# EAGLE design Daughter2 (EAGLE 9.6.2)
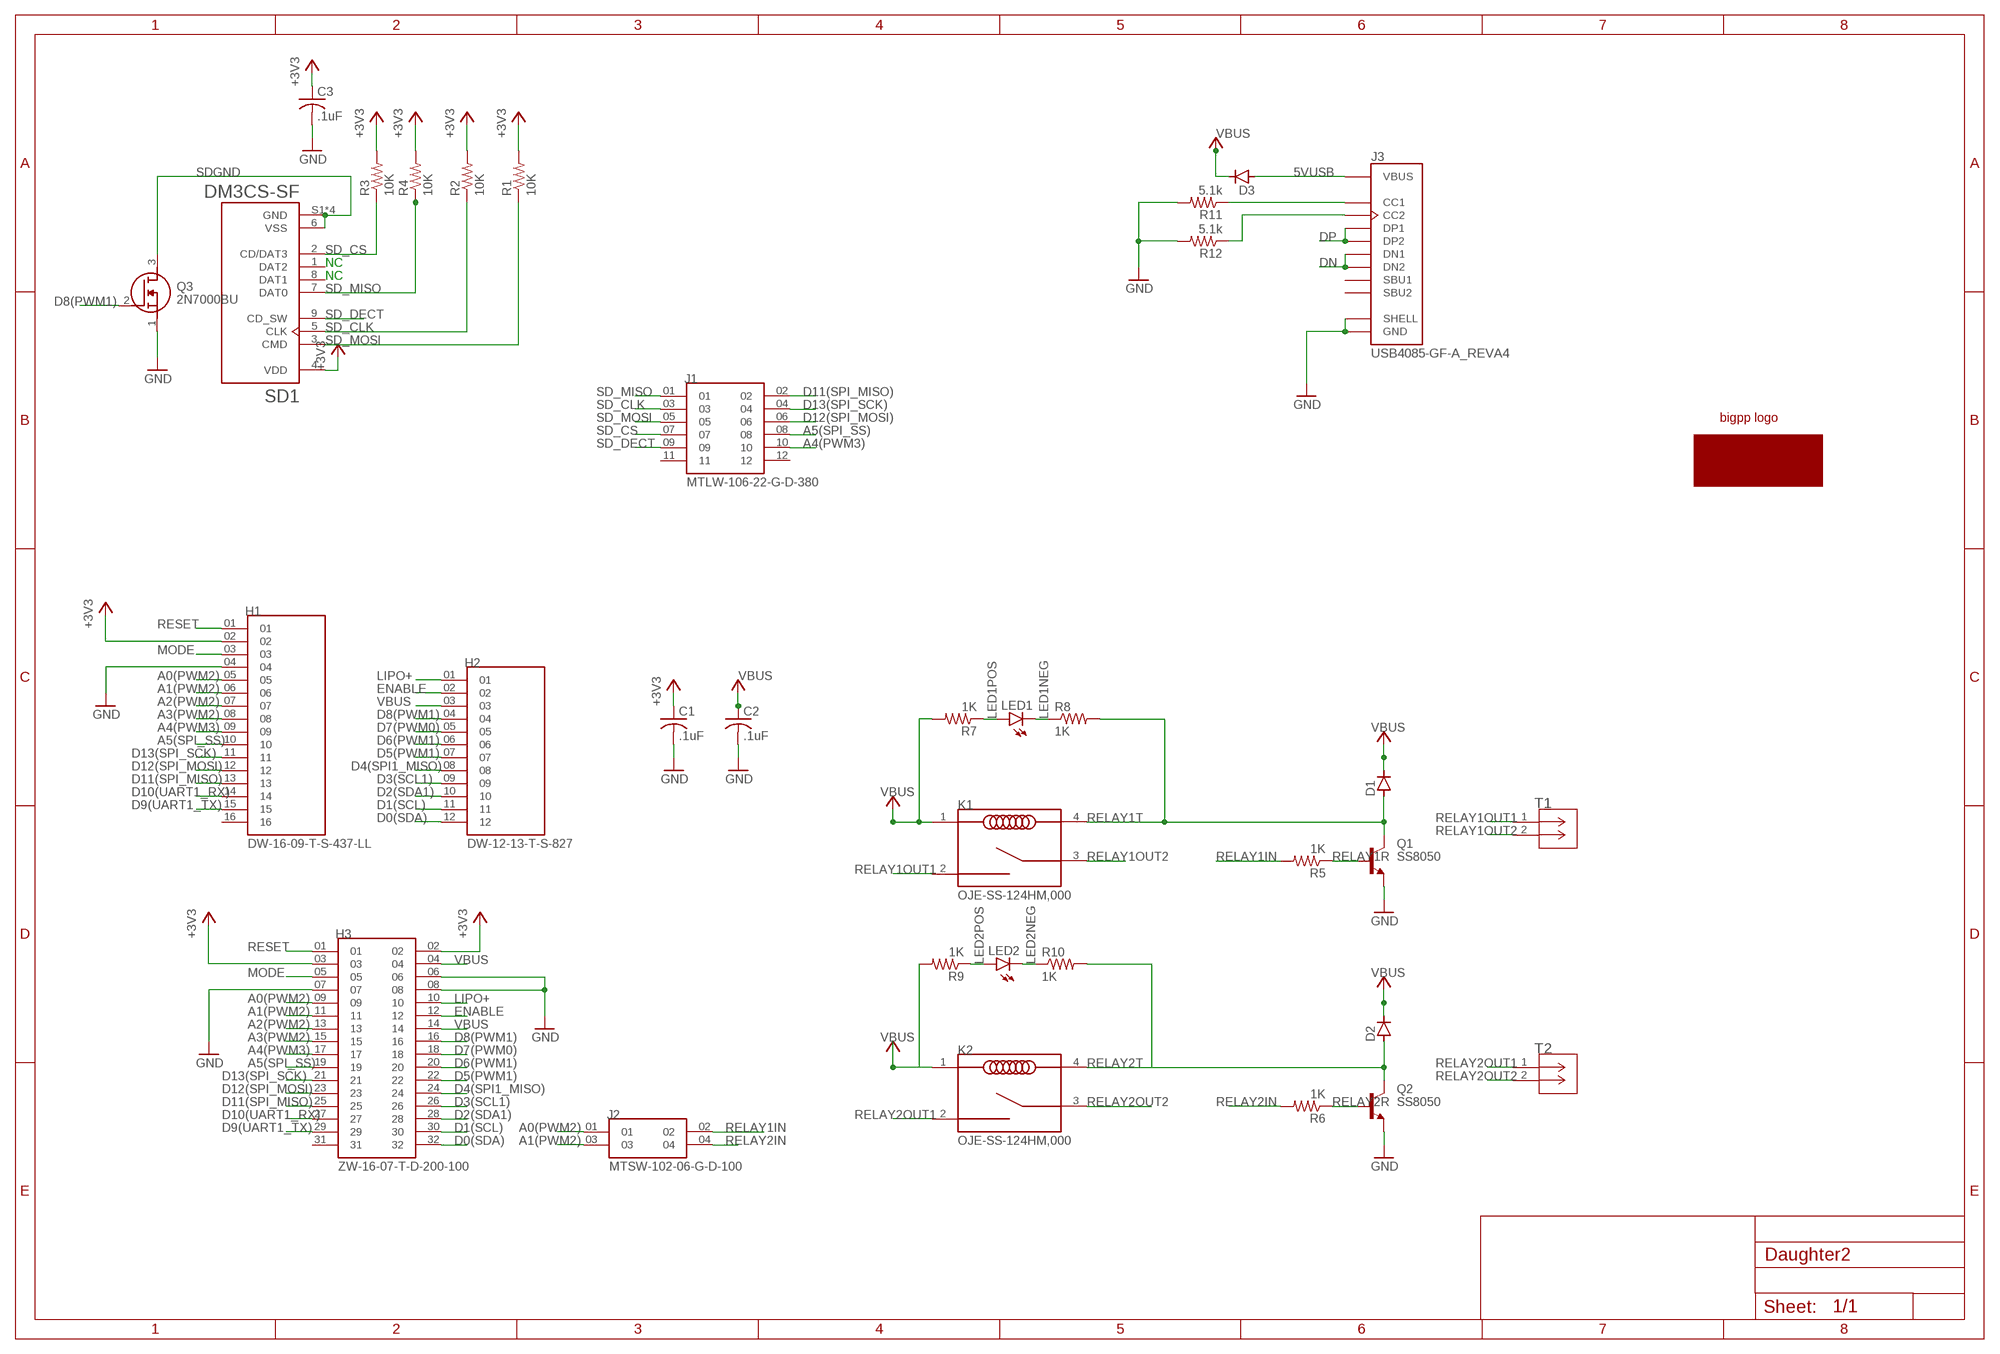
[diagram p0: schematic, sheet 1]

## Parts
C1  .1uF  C-USC0805  [C0805]
C2  .1uF  C-USC0805  [C0805]
C3  .1uF  C-USC0805  [C0805]
D1  D-SOD-80  [SOD80]
D2  D-SOD-80  [SOD80]
D3  D-SOD-80  [SOD80]
H1  DW-16-09-T-S-437-LL  [SAMTEC_DW-16-09-T-S-437-LL]
H2  DW-12-13-T-S-827  [SAMTEC_DW-12-13-T-S-827]
H3  ZW-16-07-T-D-200-100  [SAMTEC_ZW-16-07-T-D-200-100]
J1  MTLW-106-22-G-D-380  [SAMTEC_MTLW-106-22-G-D-380]
J2  MTSW-102-06-G-D-100  [SAMTEC_MTSW-102-06-G-D-100]
J3  USB4085-GF-A_REVA4  [GCT_USB4085-GF-A_REVA4]
K1  OJE-SS-124HM,000  [RELAY_OJE-SS-124HM,000]
K2  OJE-SS-124HM,000  [RELAY_OJE-SS-124HM,000]
LED1  LEDCHIP-LED0603  [CHIP-LED0603]
LED2  LEDCHIP-LED0603  [CHIP-LED0603]
Q1  SS8050  [SOT-23_BEC]
Q2  SS8050  [SOT-23_BEC]
Q3  2N7000BU  [2N6027]
R1  10K  R-US_R0805  [R0805]
R2  10K  R-US_R0805  [R0805]
R3  10K  R-US_R0805  [R0805]
R4  10K  R-US_R0805  [R0805]
R5  1K  R-US_R0805  [R0805]
R6  1K  R-US_R0805  [R0805]
R7  1K  R-US_R0805  [R0805]
R8  1K  R-US_R0805  [R0805]
R9  1K  R-US_R0805  [R0805]
R10  1K  R-US_R0805  [R0805]
R11  5.1k  R-US_R0805  [R0805]
R12  5.1k  R-US_R0805  [R0805]
SD1  DM3CS-SF  [HRS_DM3CS-SF]
T1  OSTVN02A150  [CONN_OSTVN02A150_OST]
T2  OSTVN02A150  [CONN_OSTVN02A150_OST]
U$1  BIGPP  [BIGPP]

## Nets
5VUSB: D3.2(A) J3.A4(VBUS) J3.A9(VBUS) J3.B4(VBUS) J3.B9(VBUS)
+3V3: C1.1 C3.1 H1.02 H3.02 H3.03 R1.2 R2.2 R3.2 R4.2 SD1.4(VDD)
A0(PWM2): H1.05 H3.09 J2.01
A1(PWM2): H1.06 H3.11 J2.03
A2(PWM2): H1.07 H3.13
A3(PWM2): H1.08 H3.15
A4(PWM3): H1.09 H3.17 J1.10
A5(SPI_SS): H1.10 H3.19 J1.08
D0(SDA): H2.12 H3.32
D1(SCL): H2.11 H3.30
D2(SDA1): H2.10 H3.28
D3(SCL1): H2.09 H3.26
D4(SPI1_MISO): H2.08 H3.24
D5(PWM1): H2.07 H3.22
D6(PWM1): H2.06 H3.20
D7(PWM0): H2.05 H3.18
D8(PWM1): H2.04 H3.16 Q3.2(G)
D9(UART1_TX): H1.15 H3.29
D10(UART1_RX): H1.14 H3.27
D11(SPI_MISO): H1.13 H3.25 J1.02
D12(SPI_MOSI): H1.12 H3.23 J1.06
D13(SPI_SCK): H1.11 H3.21 J1.04
DN: J3.A7(DN1) J3.B7(DN2)
DP: J3.A6(DP1) J3.B6(DP2)
ENABLE: H2.02 H3.12
GND: C1.2 C2.2 C3.2 H1.04 H3.06 H3.07 H3.08 J3.A1(GND) J3.A12(GND) J3.B1(GND) J3.B12(GND) J3.P1(SHELL) J3.P2(SHELL) J3.P3(SHELL) J3.P4(SHELL) Q1.E Q2.E Q3.1(S) R11.2 R12.2
LED1NEG: LED1.C R8.1
LED1POS: LED1.A R7.1
LED2NEG: LED2.C R10.1
LED2POS: LED2.A R9.1
LIPO+: H2.01 H3.10
MODE: H1.03 H3.05
N$1: J3.A5(CC1) R11.1
N$4: J3.B5(CC2) R12.1
RELAY1IN: J2.02 R5.2
RELAY1OUT1: K1.2 T1.1
RELAY1OUT2: K1.3 T1.2
RELAY1R: Q1.B R5.1
RELAY1T: D1.2(A) K1.4 Q1.C R8.2
RELAY1T1: R10.2
RELAY2IN: J2.04 R6.2
RELAY2OUT1: K2.2 T2.1
RELAY2OUT2: K2.3 T2.2
RELAY2R: Q2.B R6.1
RELAY2T: D2.2(A) K2.4 Q2.C
RESET: H1.01 H3.01
SD_CLK: J1.03 R2.1 SD1.5(CLK)
SD_CS: J1.07 R3.1 SD1.2(CD/DAT3)
SD_DECT: J1.09 SD1.9(CD_SW)
SD_MISO: J1.01 R4.1 SD1.7(DAT0)
SD_MOSI: J1.05 R1.1 SD1.3(CMD)
SDGND: Q3.3(D) SD1.6(VSS) SD1.S1(GND) SD1.S2(GND) SD1.S3(GND) SD1.S5(GND)
VBUS: C2.1 D1.1(C) D2.1(C) D3.1(C) H2.03 H3.04 H3.14 K1.1 K2.1 R7.2 ; supply symbol labelled VCC
VBUS1: R9.2
Unconnected: H1.16 H3.31 J1.11 J1.12 J3.A8(SBU1) J3.B8(SBU2) SD1.1(DAT2) SD1.8(DAT1)

## Notes on the sheet
- NC
- NC

## Library data of the parts
C1-C3 = rcl:C-US: CAPACITOR, American symbol; SPICEPREFIX: C
D1-D3 = semicon-smd-ipc:D-: DIODE unfilled
H1 = DW-16-09-T-S-437-LL:DW-16-09-T-S-437-LL: Check availability <https://pricing.snapeda.com/parts/DW-16-09-T-S-437-LL/Samtec/view-part?ref=eda>; AVAILABILITY: In Stock; DESCRIPTION: 16 Position Header Spacer Connector 0.100 (2.54mm) Tin Through Hole; MF: Samtec; MP: DW-16-09-T-S-437-LL; PACKAGE: None; PRICE: None; PURCHASE-URL: https://pricing.snapeda.com/search/part/DW-16-09-T-S-437-LL/?ref=eda
H2 = DW-12-13-T-S-827:DW-12-13-T-S-827: Check availability <https://pricing.snapeda.com/parts/DW-12-13-T-S-827/Samtec%20Inc./view-part?ref=eda>; AVAILABILITY: In Stock; DESCRIPTION: 12 Position Header Spacer Connector 0.100 (2.54mm) Tin Through Hole; MF: Samtec Inc.; MP: DW-12-13-T-S-827; PACKAGE: None; PRICE: None; PURCHASE-URL: https://pricing.snapeda.com/search/part/DW-12-13-T-S-827/?ref=eda
H3 = ZW-16-07-T-D-200-100:ZW-16-07-T-D-200-100: Check availability <https://pricing.snapeda.com/parts/ZW-16-07-T-D-200-100/Samtec%20Inc./view-part?ref=eda>; AVAILABILITY: In Stock; DESCRIPTION: 32 Position Header Spacer Connector 0.100 (2.54mm) Tin Through Hole; MF: Samtec Inc.; MP: ZW-16-07-T-D-200-100; PACKAGE: None; PRICE: None; PURCHASE-URL: https://pricing.snapeda.com/search/part/ZW-16-07-T-D-200-100/?ref=eda
J1 = MTLW-106-22-G-D-380:MTLW-106-22-G-D-380: Check availability <https://pricing.snapeda.com/parts/MTLW-106-22-G-D-380/Samtec/view-part?ref=eda>; AVAILABILITY: In Stock; DESCRIPTION: CONN HEADER VERT 12POS 2.54MM; MF: Samtec; MP: MTLW-106-22-G-D-380; PACKAGE: None; PRICE: None; PURCHASE-URL: https://pricing.snapeda.com/search/part/MTLW-106-22-G-D-380/?ref=eda
J2 = MTSW-102-06-G-D-100:MTSW-102-06-G-D-100: Check availability <https://pricing.snapeda.com/parts/MTSW-102-06-G-D-100/Samtec%20Inc./view-part?ref=eda>; AVAILABILITY: In Stock; DESCRIPTION: Connector Header Through Hole 4 position 0.100 (2.54mm); MF: Samtec Inc.; MP: MTSW-102-06-G-D-100; PACKAGE: None; PRICE: None; PURCHASE-URL: https://pricing.snapeda.com/search/part/MTSW-102-06-G-D-100/?ref=eda
J3 = USB4085-GF-A_REVA4:USB4085-GF-A_REVA4: USB 2.0 Type C Receptacle Dip Type, PCB Top Mount Check availability <https://pricing.snapeda.com/parts/USB4085-GF-A/Global%20Connector%20Technology/view-part?ref=eda>; AVAILABILITY: In Stock; DESCRIPTION: USB-C (USB TYPE-C) USB 2.0 Receptacle Connector 24 (16+8 Dummy) Position Through Hole, Right Angle, low cost, 3.46mm profile, 16 pin, horizontal, Top mount; MF: Global Connector Technology; MP: USB4085-GF-A; PACKAGE: None; PRICE: None; PURCHASE-URL: https://pricing.snapeda.com/search/part/USB4085-GF-A/?ref=eda
K1 K2 = OJE-SS-124HM_000:OJE-SS-124HM,000: Electromechanical Relay 24VDC 1.28KOhm 10A SPST-NO( (18.2mm 10.2mm 14.7mm)) THT Miniature Relay Check availability <https://pricing.snapeda.com/parts/OJE-SS-124HM%2C000/TE%20Connectivity/view-part?ref=eda>; AVAILABILITY: In Stock; COMMENT: 6-1419128-4; DESCRIPTION: Electromechanical Relay 24VDC 1.28KOhm 10A SPST-NO( (18.2mm 10.2mm 14.7mm)) THT Miniature Relay; MF: TE Connectivity; MP: OJE-SS-124HM,000; PACKAGE: None; PRICE: None; PURCHASE-URL: https://pricing.snapeda.com/search/part/OJE-SS-124HM,000/?ref=eda
LED1 LED2 = led:LED: LED OSRAM: - CHIPLED LG R971, LG N971, LY N971, LG Q971, LY Q971, LO R971, LY R971 LH N974, LH R974 LS Q976, LO Q976, LY Q976 LO Q996 - Hyper CHIPLED LW Q18S LB Q993, LB Q99A, LB R99A - SideLED LS A670, LO A670, LY A670, LG A670, LP A670 LB A673, LV A673, LT A673, LW A673 LH A674 LY A675 LS A676, LA A676, LO A676, LY A676, LW A676 LS A679, LY A679, LG A679 - Hyper Micro SIDELED® LS Y876, LA Y876, LO Y876, LY Y876 LT Y87S - SmartLED LW L88C, LW L88S LB L89C, LB L89S, LG L890 LS L89K, LO L89K, LY L89K LS L896, LA L896, LO L896, LY L896 - TOPLED LS T670, LO T670, LY T670, LG T670, LP T670 LSG T670, LSP T670, LSY T670, LOP T670, LYG T670 LG T671, LOG T671, LSG T671 LB T673, LV T673, LT T673, LW T673 LH T674 LS T676, LA T676, LO T676, LY T676, LB T676, LH T676, LSB T676, LW T676 LB T67C, LV T67C, LT T67C, LS T67K, LO T67K, LY T67K, LW E67C LS E67B, LA E67B, LO E67B, LY E67B, LB E67C, LV E67C, LT E67C LW T67C LS T679, LY T679, LG T679 LS T770, LO T770, LY T770, LG T770, LP T770 LB T773, LV T773, LT T773, LW T773 LH T774 LS E675, LA E675, LY E675, LS T675 LS T776, LA T776, LO T776, LY T776, LB T776 LHGB T686 LT T68C, LB T68C - Hyper Mini TOPLED® LB M676 - Mini TOPLED Santana® LG M470 LS M47K, LO M47K, LY M47K Source: http://www.osram.convergy.de LUXEON: - LUMILED® LXK2-PW12-R00, LXK2-PW12-S00, LXK2-PW14-U00, LXK2-PW14-V00 LXK2-PM12-R00, LXK2-PM12-S00, LXK2-PM14-U00 LXK2-PE12-Q00, LXK2-PE12-R00, LXK2-PE12-S00, LXK2-PE14-T00, LXK2-PE14-U00 LXK2-PB12-K00, LXK2-PB12-L00, LXK2-PB12-M00, LXK2-PB14-N00, LXK2-PB14-P00, LXK2-PB14-Q00 LXK2-PR12-L00, LXK2-PR12-M00, LXK2-PR14-Q00, LXK2-PR14-R00 LXK2-PD12-Q00, LXK2-PD12-R00, LXK2-PD12-S00 LXK2-PH12-R00, LXK2-PH12-S00 LXK2-PL12-P00, LXK2-PL12-Q00, LXK2-PL12-R00 Source: www.luxeon.com KINGBRIGHT: KA-3528ASYC Source: www.kingbright.com
Q1 Q2 = SS8050:SS8050: NPN de proposito general Vce=40V , Ic=1.5A - 0.3W Check availability <https://pricing.snapeda.com/parts/SS8050/Microdiode%20Electronics/view-part?ref=eda>; AVAILABILITY: In Stock; DESCRIPTION: Bipolar (BJT) Transistor NPN 25V 1.5A 100MHz 625mW Surface Mount SOT-23; MF: Microdiode Electronics; MP: SS8050; PACKAGE: TO-236-3 Microdiode Electronics; PRICE: None; PURCHASE-URL: https://pricing.snapeda.com/search/part/SS8050/?ref=eda
Q3 = 2N7000BU:2N7000BU: ON SEMICONDUCTOR - 2N7000BU - MOSFET Transistor, N Channel, 200 mA, 60 V, 5 ohm, 10 V, 3.9 V Source: Datasheet <https://www.mouser.com/datasheet/2/308/2N7000-D-33553.pdf>; ARROW_PART_NUMBER: 2N7000BU; ARROW_PRICE-STOCK: https://www.arrow.com/en/products/2n7000bu/on-semiconductor?region=nac; DESCRIPTION: ON SEMICONDUCTOR - 2N7000BU - MOSFET Transistor, N Channel, 200 mA, 60 V, 5 ohm, 10 V, 3.9 V; HEIGHT: mm; MANUFACTURER_NAME: onsemi; MANUFACTURER_PART_NUMBER: 2N7000BU; MOUSER_PART_NUMBER: 512-2N7000BU; MOUSER_PRICE-STOCK: https://www.mouser.co.uk/ProductDetail/ON-Semiconductor-Fairchild/2N7000BU?qs=k2x4EL1%2FKj6oeXMHAfSm5A%3D%3D
R1-R12 = rcl:R-US_: RESISTOR, American symbol; SPICEPREFIX: R
SD1 = DM3CS-SF:DM3CS-SF: CONN MICRO SD CARD HINGED TYPE Check availability <https://pricing.snapeda.com/parts/DM3CS-SF/Hirose/view-part?ref=eda>; AVAILABILITY: In Stock; DESCRIPTION: 10 (8 + 2) Position Card Connector Secure Digital - microSD™ Surface Mount, Right Angle Gold; MF: Hirose; MP: DM3CS-SF; PACKAGE: None; PRICE: None; PURCHASE-URL: https://pricing.snapeda.com/search/part/DM3CS-SF/?ref=eda
T1 T2 = OSTVN02A150:OSTVN02A150; COPYRIGHT: Copyright (C) 2022 Ultra Librarian. All rights reserved.; MANUFACTURER_PART_NUMBER: OSTVN02A150; MFR_NAME: On Shore Technology
U$1 = bigpp:BIGPP

## Net classes
0 default: width 0.305 mm, drill 0.254 mm, clearance 0.127 mm

## Board
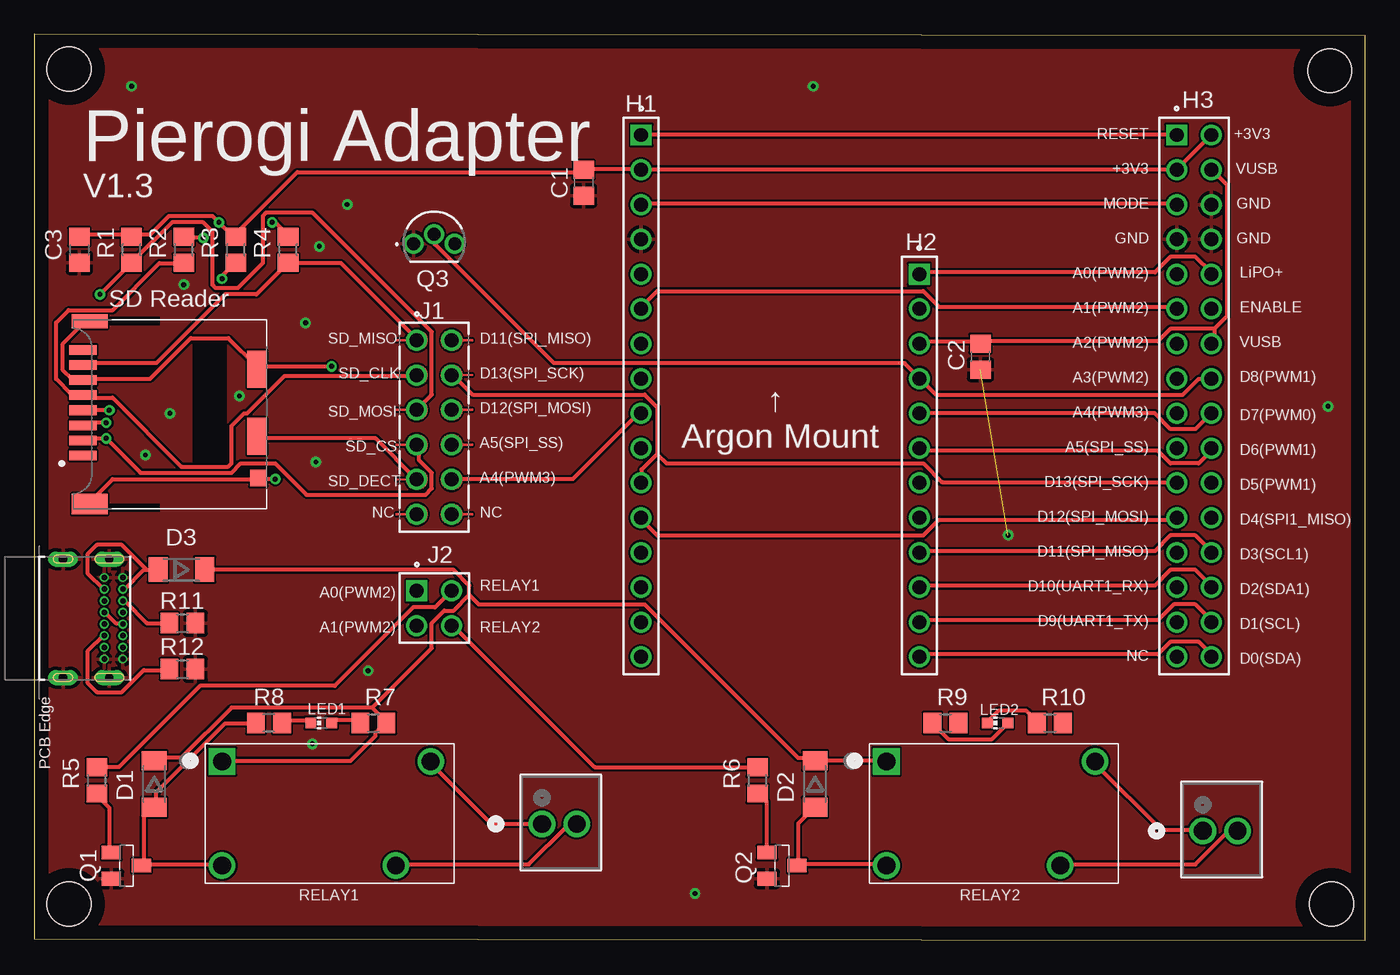
[diagram p1: board, top side]
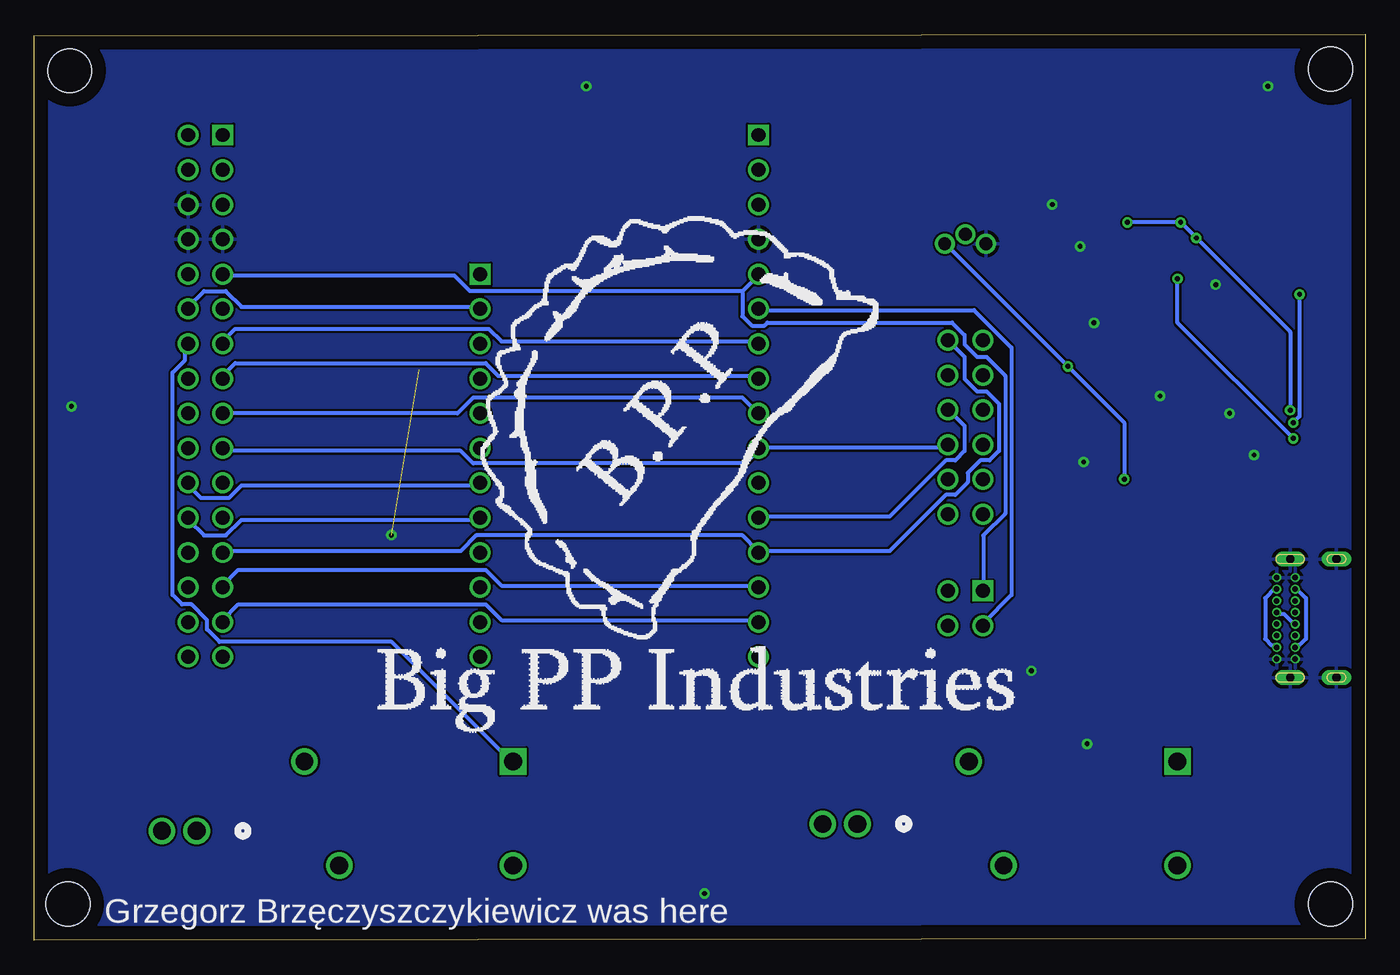
[diagram p2: board, bottom side, seen from below]

Size 97.21 x 66.16 mm. Coordinates in mm from the lower left corner, seen from the top.
Outline: 0,0.13 97.21,0 97.21,66.03 0,66.16 0,0.13
Copper layers (1*16): Top 0.035mm / dielectric 1.5mm / Bottom 0.035mm
Design rules "default *": minimum track width 6mil, minimum drill 0.35mm, track to track 6mil, track to pad 6mil, pad to pad 6mil, via to via 6mil, smd to smd 6mil, copper to edge 40mil, drill to drill 6mil, minimum pad ring 4mil, minimum via ring 8mil, stop-mask expansion 4mil, vias tented up to drill 0mil, thermal gap 10mil
Holes 3.2 mm at 2.54,63.63 94.61,63.5 2.54,2.67 94.74,2.67

### Footprints (pad centres in the part's own frame; a part is rotated, then mirrored left to right if it is on the bottom)
C0805 = smd 1.3 x 1.5: 1 -0.95,0; 2 0.95,0
SOD80 = smd 1.4 x 1.8: 1 -1.7,0; 2 1.7,0
SAMTEC_DW-16-09-T-S-437-LL = drill 1.02 pad 1.37 square: 01 0,0 | drill 1.02 pad 1.37: 02 2.54,0; 03 5.08,0; 04 7.62,0; 05 10.16,0; 06 12.7,0; 07 15.24,0; 08 17.78,0; 09 20.32,0; 10 22.86,0; 11 25.4,0; 12 27.94,0; 13 30.48,0; 14 33.02,0; 15 35.56,0; 16 38.1,0
SAMTEC_DW-12-13-T-S-827 = drill 1.02 pad 1.37 square: 01 0,0 | drill 1.02 pad 1.37: 02 2.54,0; 03 5.08,0; 04 7.62,0; 05 10.16,0; 06 12.7,0; 07 15.24,0; 08 17.78,0; 09 20.32,0; 10 22.86,0; 11 25.4,0; 12 27.94,0
SAMTEC_ZW-16-07-T-D-200-100 = drill 1.02 pad 1.37 square: 01 0,0 | drill 1.02 pad 1.37: 02 0,2.54; 03 2.54,0; 04 2.54,2.54; 05 5.08,0; 06 5.08,2.54; 07 7.62,0; 08 7.62,2.54; 09 10.16,0; 10 10.16,2.54; 11 12.7,0; 12 12.7,2.54; 13 15.24,0; 14 15.24,2.54; 15 17.78,0; 16 17.78,2.54; 17 20.32,0; 18 20.32,2.54; 19 22.86,0; 20 22.86,2.54; 21 25.4,0; 22 25.4,2.54; 23 27.94,0; 24 27.94,2.54; 25 30.48,0; 26 30.48,2.54; 27 33.02,0; 28 33.02,2.54; 29 35.56,0; 30 35.56,2.54; 31 38.1,0; 32 38.1,2.54
SAMTEC_MTLW-106-22-G-D-380 = drill 1.02 pad 1.52: 01 -6.35,-1.27; 02 -6.35,1.27; 03 -3.81,-1.27; 04 -3.81,1.27; 05 -1.27,-1.27; 06 -1.27,1.27; 07 1.27,-1.27; 08 1.27,1.27; 09 3.81,-1.27; 10 3.81,1.27; 11 6.35,-1.27; 12 6.35,1.27
SAMTEC_MTSW-102-06-G-D-100 = drill 1.02 pad 1.37 square: 01 0,0 | drill 1.02 pad 1.37: 02 0,2.54; 03 2.54,0; 04 2.54,2.54
GCT_USB4085-GF-A_REVA4 = drill 0.4 pad 0.65: A1 -2.975,4.025; A4 -2.125,4.025; A5 -1.275,4.025; A6 -0.425,4.025; A7 0.425,4.025; A8 1.275,4.025; A9 2.125,4.025; A12 2.975,4.025; B1 2.975,2.675; B4 2.125,2.675; B5 1.275,2.675; B6 0.425,2.675; B7 -0.425,2.675; B8 -1.275,2.675; B9 -2.125,2.675; B12 -2.975,2.675 | drill 0.6 pad 1.108 long: P1 -4.325,3.045; P2 4.325,3.045; P3 4.325,-0.335; P4 -4.325,-0.335
RELAY_OJE-SS-124HM,000 = drill 1.3 square: 1 -7.62,3.8 | drill 1.3: 2 7.62,3.8; 3 5.08,-3.8; 4 -7.62,-3.8
CHIP-LED0603 = smd 0.8 x 0.8: A 0,-0.75; C 0,0.75
SOT-23_BEC = smd 1 x 1.4: B -0.95,-1.1; C 0,1.1; E 0.95,-1.1
2N6027 = drill 0.93 pad 1.45: 1 -1.5,-2.35; 2 0,-1.65; 3 1.5,-2.35
R0805 = smd 1.3 x 1.5: 1 -0.95,0; 2 0.95,0
HRS_DM3CS-SF = smd 0.7 x 2: 1 3.2,-6.35; 2 2.1,-6.35; 3 1,-6.35; 4 -0.1,-6.35; 5 -1.2,-6.35; 6 -2.3,-6.35; 7 -3.4,-6.35; 8 -4.5,-6.35 | smd 2.7 x 1.4: 9 1.8,6.35; S3 -3.1,6.35 | smd 1 x 2.6: S1 -6.6,-5.85 | smd 1.5 x 2.6: S2 6.75,-5.85 | smd 1.2 x 1.2: S5 4.85,6.45
CONN_OSTVN02A150_OST = drill 1.295 pad 1.803: 1 0,0; 2 2.54,0

### Placement (x,y rotation side)
C1  40.13,55.32 270 top
C2  69.11,42.62 270 top
C3  3.3,50.42 270 top
D1  8.76,11.43 270 top
D2  57.02,11.43 270 top
D3  10.74,27.08 180 top
H1  44.32,58.8 270 top
H2  64.64,48.64 270 top
H3  83.44,58.8 270 top
J1  29.21,37.47 270 top
J2  27.94,25.53 270 top
J3  2.44,23.52 270 top
K1  21.34,9.27 0 top
K2  69.85,9.27 0 top
LED1  20.95,15.88 90 top
LED2  70.36,15.88 90 top
Q1  6.73,5.46 270 top
Q2  54.61,5.46 270 top
Q3  29.21,53.21 0 top
R1  7.11,50.42 90 top
R2  10.92,50.42 90 top
R3  14.73,50.42 90 top
R4  18.54,50.42 90 top
R5  4.57,11.68 90 top
R6  52.83,11.68 90 top
R7  24.77,15.88 0 top
R8  17.14,15.88 180 top
R9  66.55,15.88 0 top
R10  74.17,15.88 0 top
R11  10.82,23.16 0 top
R12  10.82,19.81 0 top
SD1  9.91,38.61 270 top
T1  37.08,8.51 0 top
T2  85.34,8 0 top
U$1  72.9,17.14 0 bottom

### Tracks (layer width: path | path; a pad name or v marks a point on that pad's centre or on a via)
5VUSB
  Top 0.305: 8.23,27.05 8,27.05 6.63,25.68 J3.A4 | 8.23,27.05 8.91,27.05 D3.2 | 8.23,27.05 6.4,28.88 4.57,28.88 3.89,28.19 3.89,26.82 5.03,25.68 J3.B9
  Bottom 0.305: J3.B4 5.03,21.57 4.8,21.57 4.34,22.02 4.34,24.99 5.03,25.68 J3.B9 | J3.A9 6.63,21.57 6.86,21.57 7.32,22.02 7.32,24.99 6.63,25.68 J3.A4
+3V3  (via drill 0.35)
  Top 0.305: 83.44,56.31 85.95,58.83 H3.02 | C3.1 3.43,51.51 7.09,51.51 R1.2 7.32,51.51 8.46,51.51 9.83,52.88 13.03,52.88 v13.49,52.43 14.63,51.28 R3.2 14.63,51.51 19.2,56.08 40.01,56.08 C1.1 40.23,56.31 44.12,56.31 H1.02 44.35,56.31 83.44,56.31 | v12.34,51.28 10.97,51.28 R2.2 | v17.37,52.43 17.6,52.43 18.52,51.51 R4.2 | v5.49,38.71 3.66,38.71 SD1.4 | 83.44,56.31 H3.03
  Bottom 0.305: v17.37,52.43 v13.49,52.43 v12.34,51.28 5.49,44.42 v5.49,38.71
A0(PWM2)
  Bottom 0.305: 45.49,47.4 45.49,45.57 44.81,44.88 43.89,44.88 43.66,45.11 30.18,45.11 29.26,44.2 29.26,43.51 28.35,42.6 27.66,42.6 26.29,41.22 26.29,31.17 27.89,29.57 27.89,25.68 J2.01 | 45.49,47.4 44.35,48.54 H1.05 | 45.49,47.4 65.38,47.4 66.52,48.54 83.44,48.54 H3.09
A1(PWM2)
  Top 0.305: H3.11 83.44,46.25 66.06,46.25 64.92,47.4 45.49,47.4 44.35,46.25 H1.06
  Bottom 0.305: J2.03 27.89,23.17 25.83,25.22 25.83,43.28 28.57,46.03 44.12,46.03 H1.06
A2(PWM2)
  Bottom 0.305: H1.07 44.35,43.74 63.09,43.74 64.01,44.65 82.53,44.65 83.44,43.74 H3.13
A3(PWM2)
  Bottom 0.305: H1.08 44.35,41.22 63.32,41.22 64.24,42.14 82.53,42.14 83.44,41.22 H3.15
A4(PWM3)
  Top 0.305: J1.10 30.63,33.68 39.32,33.68 44.12,38.48 H1.09
  Bottom 0.305: H3.17 66.29,38.48 65.15,39.62 45.49,39.62 44.35,38.48 H1.09
A5(SPI_SS)
  Bottom 0.305: J1.08 30.63,36.2 30.86,35.97 44.12,35.97 H1.10 44.35,35.74 45.26,34.82 65.15,34.82 66.06,35.74 83.44,35.74 H3.19
D0(SDA)
  Top 0.305: H2.12 64.69,20.88 82.07,20.88 82.98,21.79 85.04,21.79 85.95,20.88 H3.32
D1(SCL)
  Top 0.305: H2.11 64.69,23.39 82.07,23.39 83.21,24.54 84.81,24.54 85.95,23.39 H3.30
D2(SDA1)
  Top 0.305: H2.10 64.69,25.91 81.84,25.91 82.98,27.05 84.81,27.05 85.95,25.91 H3.28
D3(SCL1)
  Top 0.305: H2.09 64.69,28.42 81.84,28.42 82.98,29.57 84.81,29.57 85.95,28.42 H3.26
D4(SPI1_MISO)
  Bottom 0.305: H2.08 64.69,30.71 82.07,30.71 83.21,29.57 84.81,29.57 85.95,30.71 H3.24
D5(PWM1)
  Bottom 0.305: H2.07 64.69,33.22 82.07,33.22 82.98,32.31 85.04,32.31 85.95,33.22 H3.22
D6(PWM1)
  Top 0.305: H2.06 64.69,35.74 82.07,35.74 82.98,34.82 85.04,34.82 85.95,35.74 H3.20
D7(PWM0)
  Top 0.305: H2.05 81.84,38.48 82.98,37.34 84.81,37.34 85.95,38.48 H3.18
D8(PWM1)
  Top 0.305: Q3.2 29.26,51.51 29.26,50.83 37.95,42.14 63.55,42.14 64.47,41.22 H2.04 64.69,41 65.84,39.85 83.9,39.85 85.04,41 85.95,41 H3.16
D9(UART1_TX)
  Bottom 0.305: H1.15 44.35,23.39 63.09,23.39 64.24,24.54 82.3,24.54 83.44,23.39 H3.29
D10(UART1_RX)
  Bottom 0.305: H1.14 44.35,25.91 63.09,25.91 64.24,27.05 82.3,27.05 83.44,25.91 H3.27
D11(SPI_MISO)
  Bottom 0.305: J1.02 29.26,42.6 29.26,41 28.35,40.08 27.66,40.08 26.75,39.17 26.75,35.74 27.43,35.05 28.12,35.05 29.03,34.14 29.03,33.45 29.95,32.54 30.63,32.54 34.75,28.42 44.12,28.42 H1.13 44.35,28.42 45.49,29.57 64.92,29.57 66.06,28.42 83.44,28.42 H3.25
D12(SPI_MOSI)
  Top 0.305: H3.23 83.44,30.71 66.06,30.71 64.92,29.57 45.49,29.57 44.35,30.71 H1.12
  Bottom 0.305: H1.12 44.12,30.94 34.75,30.94 30.63,35.05 29.95,35.05 29.26,35.74 29.26,37.57 30.4,38.71 J1.06
D13(SPI_SCK)
  Top 0.305: 45.49,35.51 44.35,34.37 44.35,33.45 H1.11 | 45.49,35.51 45.49,38.94 44.58,39.85 32,39.85 30.63,41.22 J1.04 | 45.49,35.51 46.18,34.82 64.92,34.82 66.29,33.45 83.44,33.45 H3.21
DN
  Top 0.305: J3.A7 6.4,23.17 5.94,23.17 5.26,23.85 J3.B7
DP
  Bottom 0.305: J3.B6 5.26,23.17 5.94,23.85 6.4,23.85 J3.A6
ENABLE
  Bottom 0.305: H2.02 64.69,46.25 82.07,46.25 83.21,47.4 84.81,47.4 85.95,46.25 H3.12
GND  (via drill 0.35)  (1 unrouted)
  other vias: 7.11,62.36 22.86,53.72 56.9,62.36 94.49,38.99 48.26,3.43 20.57,34.92 19.81,45.09 20.83,50.67 9.91,38.48 10.92,47.88 24.38,19.68 8.13,35.43 14.99,39.75 71.12,29.59 20.32,14.35
  pour Top: 0,67.44 97.79,67.44 97.79,-1.14 -1.27,-1.14 -1.27,67.44
  pour Bottom: -1.27,68.71 99.06,68.71 99.06,-2.41 -2.54,-2.41 -2.54,68.71
LED1NEG
  Top 0.305: LED1.C 20.12,16.08 18.29,16.08 R8.1
LED1POS
  Top 0.305: LED1.A 21.72,16.08 23.77,16.08 R7.1
LED2NEG
  Top 0.305: LED2.C 69.72,16.08 70.41,16.76 72.47,16.76 73.15,16.08 R10.1
LED2POS
  Top 0.305: LED2.A 71.09,15.85 69.95,14.71 66.75,14.71 65.61,15.85 R9.1
LIPO+
  Top 0.305: H2.01 64.69,48.77 81.84,48.77 82.98,49.91 84.81,49.91 85.95,48.77 H3.10
MODE
  Top 0.305: H1.03 44.35,53.8 83.44,53.8 H3.05
N$1
  Top 0.305: R11.1 8.23,23.17 6.63,24.77 J3.A5
N$4
  Top 0.305: R12.1 9.83,19.74 8,19.74 6.4,18.14 4.57,18.14 3.89,18.82 3.89,21.11 5.03,22.25 J3.B5
RELAY1IN
  Top 0.305: J2.02 29.26,24.31 27.66,24.31 21.95,18.59 12.12,18.59 6.17,12.65 4.57,12.65 R5.2
RELAY1OUT1
  Top 0.305: T1.1 37.03,8.53 33.38,8.53 29.03,12.88 K1.2
RELAY1OUT2
  Top 0.305: T1.2 39.55,8.31 38.86,8.31 36.12,5.56 26.52,5.56 K1.3
RELAY1R
  Top 0.305: Q1.B 5.49,6.48 5.49,9.68 4.57,10.59 R5.1
RELAY1T
  Top 0.305: 8,5.56 8,8.99 8.69,9.68 D1.2 8.91,9.91 8.91,10.82 13.95,15.85 16,15.85 R8.2 | 8,5.56 13.72,5.56 K1.4 | 8,5.56 Q1.C
RELAY2IN
  Top 0.305: R6.2 52.81,12.65 40.92,12.65 30.63,22.94 J2.04
RELAY2OUT1
  Top 0.305: T2.1 85.27,8.08 82.3,8.08 77.5,12.88 K2.2
RELAY2OUT2
  Top 0.305: T2.2 87.78,7.85 87.1,7.85 84.81,5.56 74.98,5.56 K2.3
RELAY2R
  Top 0.305: Q2.B 53.49,6.48 53.49,10.14 53.03,10.59 R6.1
RELAY2T
  Top 0.305: 55.78,5.56 55.78,8.53 56.92,9.68 D2.2 | 55.78,5.56 62.18,5.56 K2.4 | 55.78,5.56 Q2.C
RESET
  Top 0.305: H1.01 44.35,58.83 83.44,58.83 H3.01
SD_CLK
  Top 0.305: R2.1 10.74,49.45 9.14,49.45 5.71,46.03 2.52,46.03 1.6,45.11 1.6,41 2.74,39.85 3.43,39.85 SD1.5 3.66,39.62 5.71,39.62 10.74,34.59 14.17,34.59 14.4,34.82 14.4,37.57 15.32,38.48 15.54,38.48 18.29,41.22 27.89,41.22 J1.03
SD_CS  (via drill 0.35)
  Top 0.305: v13.72,48.31 13.72,48.54 14.63,49.45 R3.1 | SD1.2 3.66,36.65 v5.26,36.65 7.77,34.14 14.4,34.14 15.09,34.82 17.6,34.82 19.89,32.54 28.57,32.54 29.03,33 29.03,34.14 28.12,35.05 28.12,36.2 J1.07
  Bottom 0.305: v13.72,48.31 13.72,45.11 v5.26,36.65
SD_DECT
  Top 0.305: SD1.9 16.46,36.65 24.92,36.65 27.89,33.68 J1.09
SD_MISO
  Top 0.305: J1.01 27.89,43.97 22.4,49.45 18.75,49.45 R4.1 18.52,49.45 16.23,47.17 13.95,47.17 8.91,42.14 3.66,42.14 SD1.7
SD_MOSI  (via drill 0.35)
  Top 0.305: J1.05 28.12,38.94 29.03,39.85 29.03,44.42 20.34,53.11 16.92,53.11 16.69,52.88 16.69,49.45 14.86,47.62 13.26,47.62 13.03,47.85 13.03,51.74 12.34,52.43 10.06,52.43 7.32,49.68 R1.1 7.09,49.45 v4.8,47.17 | v5.26,37.8 3.66,37.8 SD1.3
  Bottom 0.305: v5.26,37.8 4.8,38.25 v4.8,47.17
SDGND  (via drill 0.35)
  Top 0.305: SD1.S2 4.12,32.08 5.71,33.68 16.23,33.68 SD1.S5 16.46,33.68 v17.6,33.68 | SD1.S1 3.89,45.34 2.06,43.51 2.06,41.68 2.74,41 3.43,41 SD1.6 3.66,41 8.46,41 11.43,43.97 14.17,43.97 16.23,41.91 SD1.S3 16.46,41.91 v21.72,41.91
  Bottom 0.305: Q3.3 30.63,50.83 v21.72,41.91 17.6,37.8 v17.6,33.68
VBUS
  Top 0.305: H2.03 64.69,43.74 69.04,43.74 C2.1 69.27,43.74 82.07,43.74 82.98,44.65 86.18,44.65 | 86.18,44.65 86.18,43.74 H3.14 | 86.18,44.65 87.1,45.57 87.1,55.17 86.18,56.08 H3.04 | K2.1 62.18,13.11 57.15,13.11 D2.1 56.92,13.34 55.78,13.34 44.58,24.54 32.46,24.54 31.77,25.22 | K1.1 13.72,13.11 23.09,13.11 24.92,14.94 24.92,15.16 25.6,15.85 R7.2 25.6,16.08 24.69,16.99 | 24.69,16.99 14.4,16.99 10.74,13.34 8.91,13.34 D1.1 | 31.77,25.22 31.77,25.91 30.63,27.05 12.57,27.05 D3.1 | 31.77,25.22 30.63,24.08 29.95,24.08 29.03,23.17 29.03,21.34 24.69,16.99
  Bottom 0.305: H3.14 86.18,43.51 86.18,42.37 87.1,41.45 87.1,25.22 86.41,24.54 85.72,24.54 84.58,23.39 84.58,22.71 83.67,21.79 71.09,21.79 62.41,13.11 K2.1

### Text on the board
tNames: RESET | +3V3 | +3V3 | VUSB | V1.3 | MODE | GND | Pierogi Adapter | GND | GND | A0(PWM2) | LiPO+ | SD Reader | A1(PWM2) | ENABLE | SD_MISO | D11(SPI_MISO) | A2(PWM2) | VUSB | A3(PWM2) | SD_CLK | D13(SPI_SCK) | D8(PWM1) | SD_MOSI | D12(SPI_MOSI) | A4(PWM3) | D7(PWM0) | A5(SPI_SS) | SD_CS | A5(SPI_SS) | ↑ / Argon Mount | D6(PWM1) | SD_DECT | A4(PWM3) | D13(SPI_SCK) | D5(PWM1) | D12(SPI_MOSI) | NC | NC | D4(SPI1_MISO) | D11(SPI_MISO) | D3(SCL1) | D10(UART1_RX) | RELAY1 | D2(SDA1) | A0(PWM2) | D9(UART1_TX) | A1(PWM2) | RELAY2 | D1(SCL) | NC | D0(SDA) | RELAY1 | RELAY2
bNames: Grzegorz Brzęczyszczykiewicz was here